# EAGLE design Main PCB (EAGLE 9.6.2)
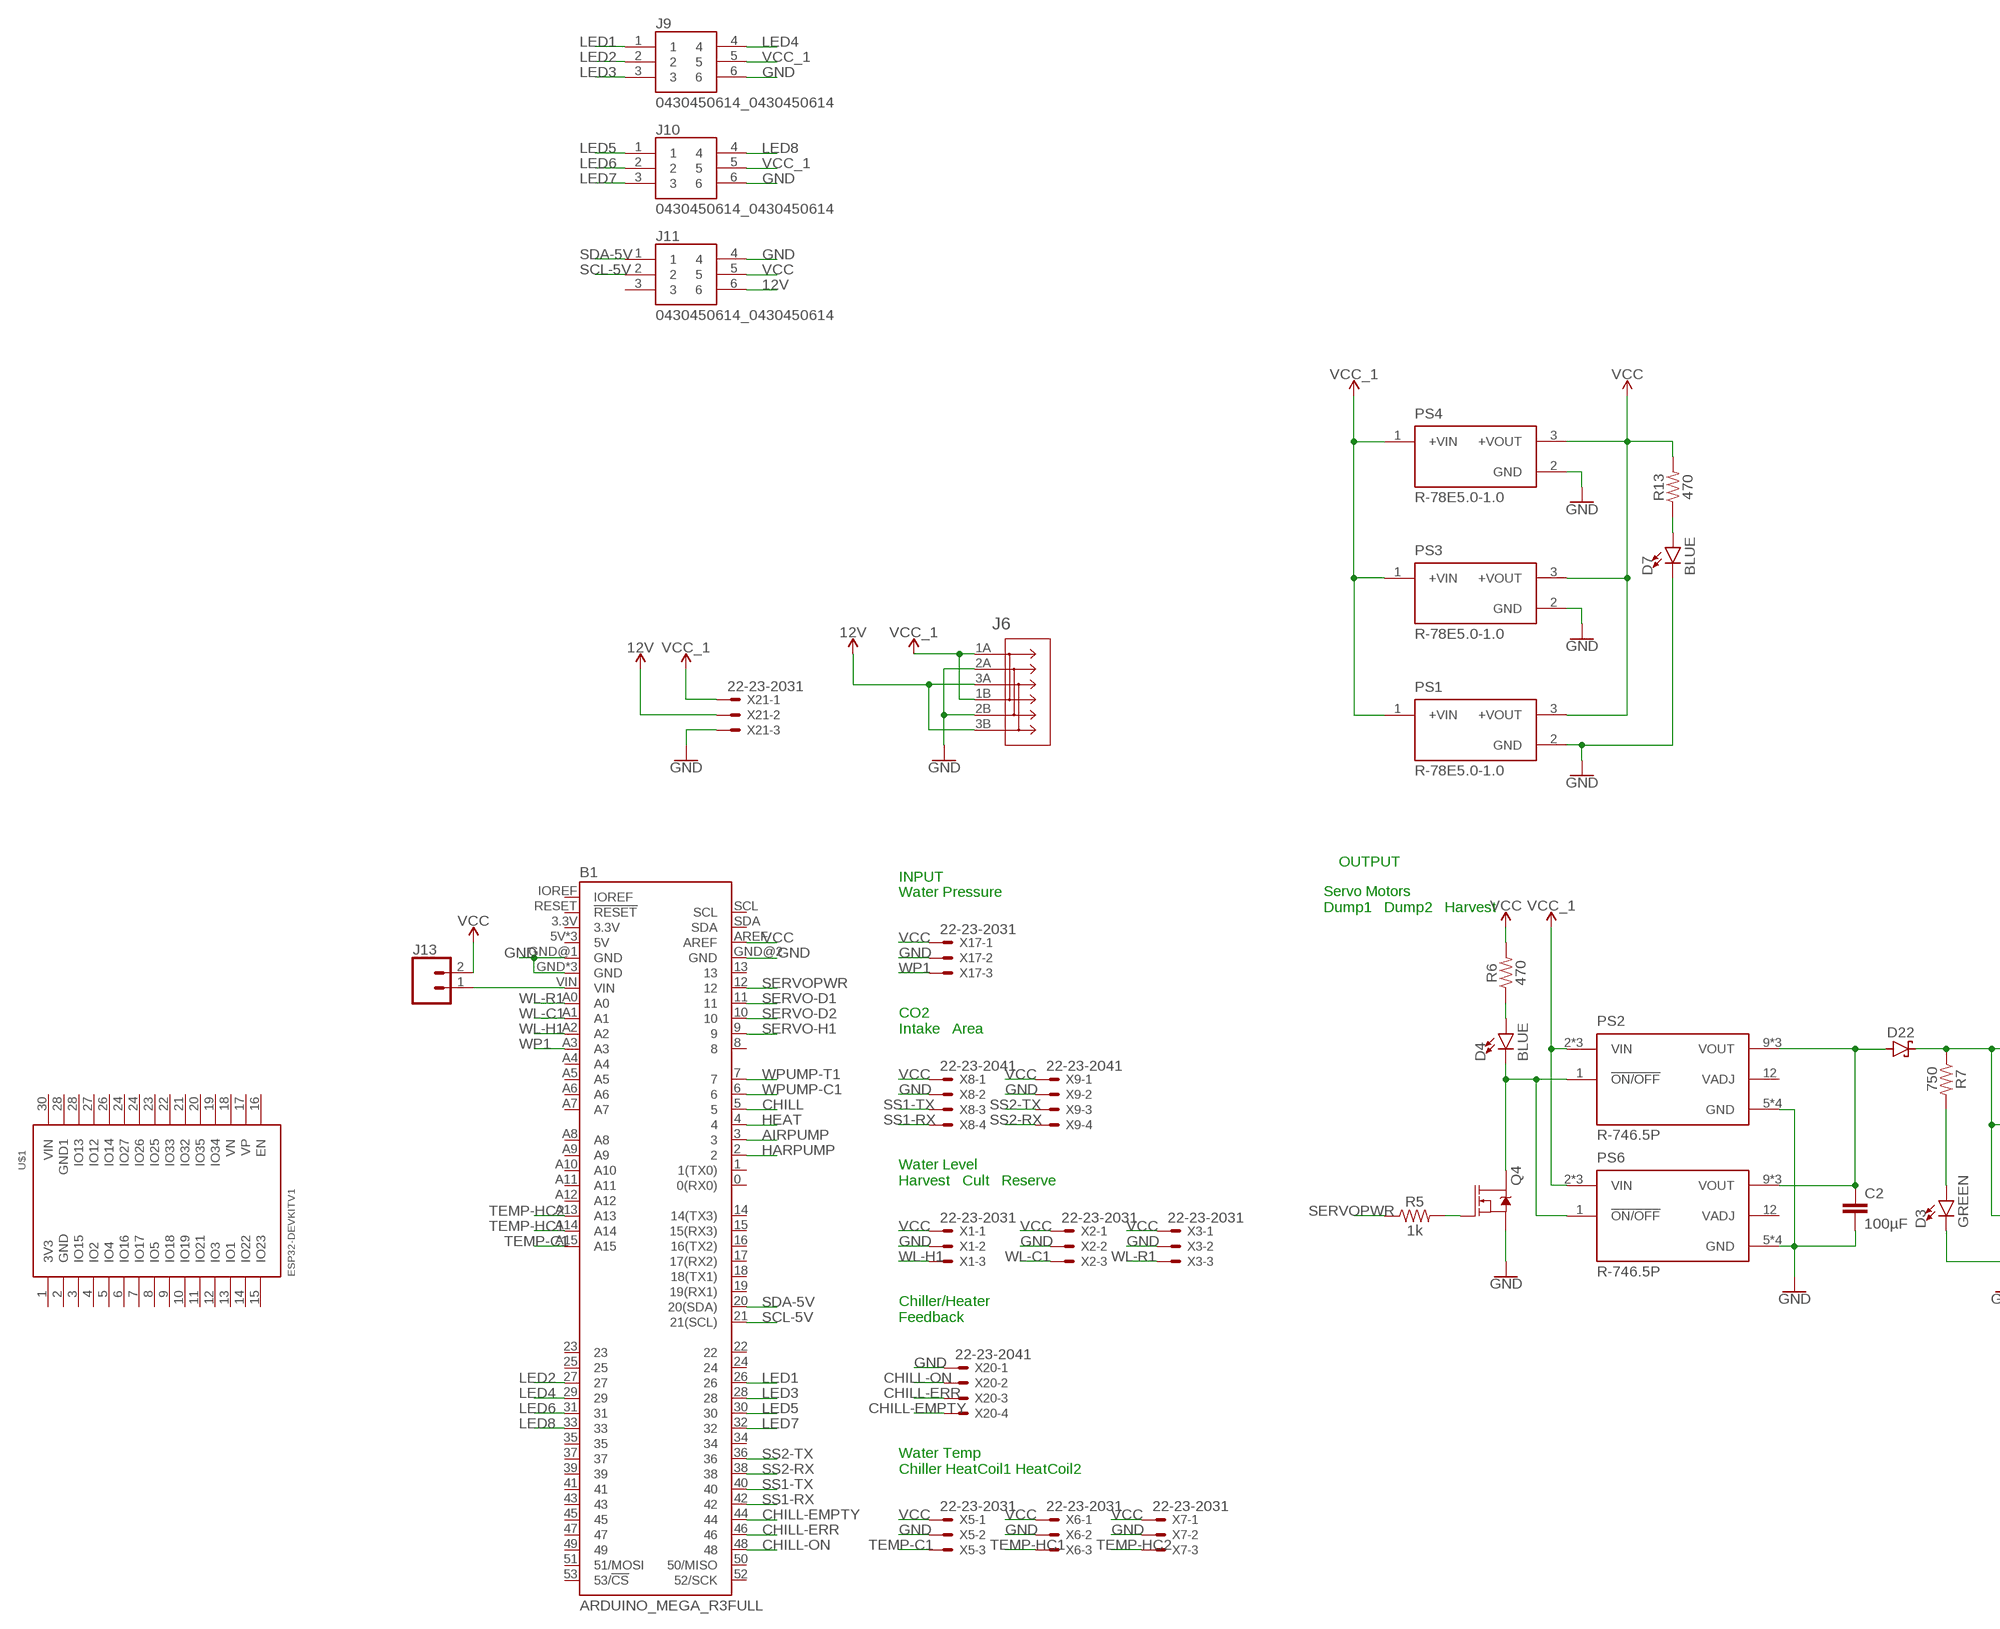
[diagram p0: schematic, sheet 1, part 1 of 2]
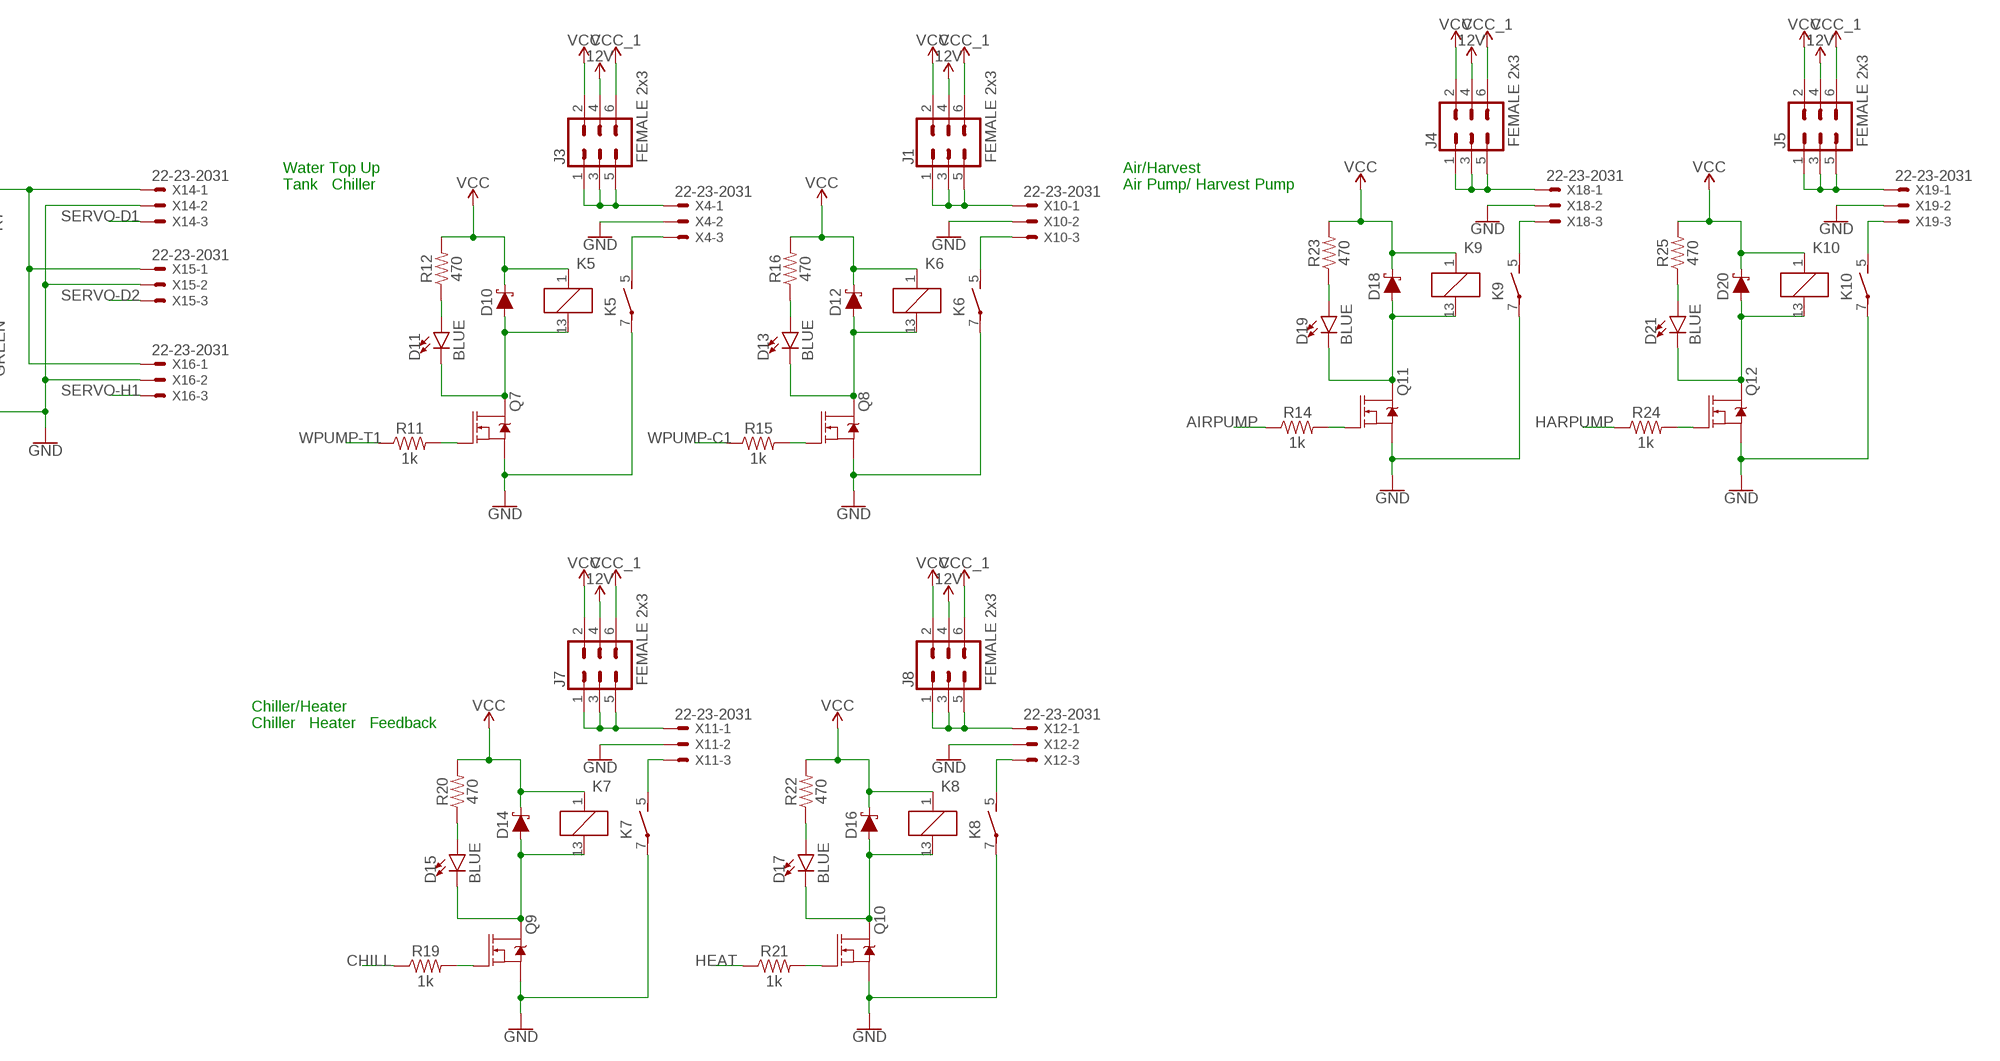
[diagram p1: schematic, sheet 1, part 2 of 2]

## Parts
B1  ARDUINO_MEGA_R3FULL  [ARDUINO_MEGA_NO_SILK]
C2  100µF  CAP-0603  [0603]
D3  GREEN  LED-GREEN0603  [LED-0603]
D4  BLUE  LED-BLUE0603  [LED-0603]
D7  BLUE  LED-BLUE0603  [LED-0603]
D10  1A/23V/620mV  DIODE-SCHOTTKY-BAT20J  [SOD-323]
D11  BLUE  LED-BLUE0603  [LED-0603]
D12  1A/23V/620mV  DIODE-SCHOTTKY-BAT20J  [SOD-323]
D13  BLUE  LED-BLUE0603  [LED-0603]
D14  1A/23V/620mV  DIODE-SCHOTTKY-BAT20J  [SOD-323]
D15  BLUE  LED-BLUE0603  [LED-0603]
D16  1A/23V/620mV  DIODE-SCHOTTKY-BAT20J  [SOD-323]
D17  BLUE  LED-BLUE0603  [LED-0603]
D18  1A/23V/620mV  DIODE-SCHOTTKY-BAT20J  [SOD-323]
D19  BLUE  LED-BLUE0603  [LED-0603]
D20  1A/23V/620mV  DIODE-SCHOTTKY-BAT20J  [SOD-323]
D21  BLUE  LED-BLUE0603  [LED-0603]
D22  SBRT20M60SP5-7SBRT20  [DIO_PDS360-13]
J1  FEMALE 2x3  CONN_03X2FEMALE  [2X3]
J3  FEMALE 2x3  CONN_03X2FEMALE  [2X3]
J4  FEMALE 2x3  CONN_03X2FEMALE  [2X3]
J5  FEMALE 2x3  CONN_03X2FEMALE  [2X3]
J6  1986711-3  [CONN3_1986711-3_TEC]
J7  FEMALE 2x3  CONN_03X2FEMALE  [2X3]
J8  FEMALE 2x3  CONN_03X2FEMALE  [2X3]
J9  0430450614_0430450614  [0430450614_MOLEX_0430450614]
J10  0430450614_0430450614  [0430450614_MOLEX_0430450614]
J11  0430450614_0430450614  [0430450614_MOLEX_0430450614]
J13  CONN_02  [1X02]
K5  G6D-1A-ASI5VDC  [G6D]
K6  G6D-1A-ASI5VDC  [G6D]
K7  G6D-1A-ASI5VDC  [G6D]
K8  G6D-1A-ASI5VDC  [G6D]
K9  G6D-1A-ASI5VDC  [G6D]
K10  G6D-1A-ASI5VDC  [G6D]
PS1  R-78E5.0-1.0  [CONV_R-78E5.0-1.0]
PS2  R-746.5P  [CONV_R-746.5P]
PS3  R-78E5.0-1.0  [CONV_R-78E5.0-1.0]
PS4  R-78E5.0-1.0  [CONV_R-78E5.0-1.0]
PS6  R-746.5P  [CONV_R-746.5P]
Q4  220mA/50V/3.5Ω  MOSFET-NCH-BSS138  [SOT23-3]
Q7  220mA/50V/3.5Ω  MOSFET-NCH-BSS138  [SOT23-3]
Q8  220mA/50V/3.5Ω  MOSFET-NCH-BSS138  [SOT23-3]
Q9  220mA/50V/3.5Ω  MOSFET-NCH-BSS138  [SOT23-3]
Q10  220mA/50V/3.5Ω  MOSFET-NCH-BSS138  [SOT23-3]
Q11  220mA/50V/3.5Ω  MOSFET-NCH-BSS138  [SOT23-3]
Q12  220mA/50V/3.5Ω  MOSFET-NCH-BSS138  [SOT23-3]
R5  1k  1KOHM-0603-1/10W-1%  [0603]
R6  470  470OHM-0603-1/10W-1%  [0603]
R7  750  750OHM-0603-1/10W-1%  [0603]
R11  1k  1KOHM-0603-1/10W-1%  [0603]
R12  470  470OHM-0603-1/10W-1%  [0603]
R13  470  470OHM-0603-1/10W-1%  [0603]
R14  1k  1KOHM-0603-1/10W-1%  [0603]
R15  1k  1KOHM-0603-1/10W-1%  [0603]
R16  470  470OHM-0603-1/10W-1%  [0603]
R19  1k  1KOHM-0603-1/10W-1%  [0603]
R20  470  470OHM-0603-1/10W-1%  [0603]
R21  1k  1KOHM-0603-1/10W-1%  [0603]
R22  470  470OHM-0603-1/10W-1%  [0603]
R23  470  470OHM-0603-1/10W-1%  [0603]
R24  1k  1KOHM-0603-1/10W-1%  [0603]
R25  470  470OHM-0603-1/10W-1%  [0603]
U$1  ESP32DEVKITV1  [ESP32-DEVKITV1]
X1  22-23-2031  [22-23-2031]
X2  22-23-2031  [22-23-2031]
X3  22-23-2031  [22-23-2031]
X4  22-23-2031  [22-23-2031]
X5  22-23-2031  [22-23-2031]
X6  22-23-2031  [22-23-2031]
X7  22-23-2031  [22-23-2031]
X8  22-23-2041  [22-23-2041]
X9  22-23-2041  [22-23-2041]
X10  22-23-2031  [22-23-2031]
X11  22-23-2031  [22-23-2031]
X12  22-23-2031  [22-23-2031]
X14  22-23-2031  [22-23-2031]
X15  22-23-2031  [22-23-2031]
X16  22-23-2031  [22-23-2031]
X17  22-23-2031  [22-23-2031]
X18  22-23-2031  [22-23-2031]
X19  22-23-2031  [22-23-2031]
X20  22-23-2041  [22-23-2041]
X21  22-23-2031  [22-23-2031]

## Nets
12V: J1.4 J3.4 J4.4 J5.4 J6.3A J6.3B J7.4 J8.4 J11.6 X21.2
AIRPUMP: B1.3 R14.1
CHILL: B1.5 R19.1
CHILL-EMPTY: B1.44 X20.4
CHILL-ERR: B1.46 X20.3
CHILL-ON: B1.48 X20.2
GND: B1.GND B1.GND@1(GND) B1.GND@2(GND) B1.GND@3(GND) B1.GND@4(GND) C2.2 D3.C D7.C J6.2A J6.2B J9.6 J10.6 J11.4 K5.7(2:P) K6.7(2:P) K7.7(2:P) K8.7(2:P) K9.7(2:P) K10.7(2:P) PS1.2(GND) PS2.5(GND) PS2.6(GND) PS2.7(GND) PS2.8(GND) PS3.2(GND) PS4.2(GND) PS6.5(GND) PS6.6(GND) PS6.7(GND) PS6.8(GND) Q4.2(S) Q7.2(S) Q8.2(S) Q9.2(S) Q10.2(S) Q11.2(S) Q12.2(S) X1.2 X2.2 X3.2 X4.2 X5.2 X6.2 X7.2 X8.2 X9.2 X10.2 X11.2 X12.2 X14.2 X15.2 X16.2 X17.2 X18.2 X19.2 X20.1 X21.3
HARPUMP: B1.2 R24.1
HEAT: B1.4 R21.1
LED1: B1.26 J9.1
LED2: B1.27 J9.2
LED3: B1.28 J9.3
LED4: B1.29 J9.4
LED5: B1.30 J10.1
LED6: B1.31 J10.2
LED7: B1.32 J10.3
LED8: B1.33 J10.4
N$1: B1.VIN J13.1
N$3: D4.C PS2.1(!ON/OFF) PS6.1(!ON/OFF) Q4.3(D)
N$5: D4.A R6.1
N$6: Q4.1(G) R5.2
N$7: D3.A R7.2
N$8: D22.3(C) R7.1 X14.1 X15.1 X16.1
N$9: J1.1 J1.3 J1.5 X10.1
N$10: J3.1 J3.3 J3.5 X4.1
N$11: K8.5(2:S) X12.3
N$12: J4.1 J4.3 J4.5 X18.1
N$13: J5.1 J5.3 J5.5 X19.1
N$14: D10.A D11.C K5.13 Q7.3(D)
N$15: D11.A R12.1
N$16: Q7.1(G) R11.2
N$17: D12.A D13.C K6.13 Q8.3(D)
N$18: D13.A R16.1
N$19: Q8.1(G) R15.2
N$20: D14.A D15.C K7.13 Q9.3(D)
N$21: D15.A R20.1
N$22: Q9.1(G) R19.2
N$23: D16.A D17.C K8.13 Q10.3(D)
N$24: D17.A R22.1
N$25: Q10.1(G) R21.2
N$26: K7.5(2:S) X11.3
N$28: J7.1 J7.3 J7.5 X11.1
N$29: D7.A R13.1
N$30: K5.5(2:S) X4.3
N$31: K6.5(2:S) X10.3
N$34: C2.1 D22.1(A) D22.2(A) PS2.9(VOUT) PS2.10(VOUT) PS2.11(VOUT) PS6.9(VOUT) PS6.10(VOUT) PS6.11(VOUT)
N$38: J8.1 J8.3 J8.5 X12.1
N$42: D18.A D19.C K9.13 Q11.3(D)
N$43: D19.A R23.1
N$44: Q11.1(G) R14.2
N$45: D20.A D21.C K10.13 Q12.3(D)
N$46: D21.A R25.1
N$47: Q12.1(G) R24.2
N$48: K10.5(2:S) X19.3
N$49: K9.5(2:S) X18.3
SCL-5V: B1.21(21(SCL)) J11.2
SDA-5V: B1.20(20(SDA)) J11.1
SERVO-D1: B1.11 X14.3
SERVO-D2: B1.10 X15.3
SERVO-H1: B1.9 X16.3
SERVOPWR: B1.12 R5.1
SS1-RX: B1.42 X8.4
SS1-TX: B1.40 X8.3
SS2-RX: B1.38 X9.4
SS2-TX: B1.36 X9.3
TEMP-C1: B1.A15 X5.3
TEMP-HC1: B1.A14 X6.3
TEMP-HC2: B1.A13 X7.3
VCC: B1.AREF D10.C D12.C D14.C D16.C D18.C D20.C J1.2 J3.2 J4.2 J5.2 J7.2 J8.2 J11.5 J13.2 K5.1 K6.1 K7.1 K8.1 K9.1 K10.1 PS1.3(+VOUT) PS3.3(+VOUT) PS4.3(+VOUT) R6.2 R12.2 R13.2 R16.2 R20.2 R22.2 R23.2 R25.2 X1.1 X2.1 X3.1 X5.1 X6.1 X7.1 X8.1 X9.1 X17.1
VCC_1: J1.6 J3.6 J4.6 J5.6 J6.1A J6.1B J7.6 J8.6 J9.5 J10.5 PS1.1(+VIN) PS2.2(VIN) PS2.3(VIN) PS2.4(VIN) PS3.1(+VIN) PS4.1(+VIN) PS6.2(VIN) PS6.3(VIN) PS6.4(VIN) X21.1
WL-C1: B1.A1 X2.3
WL-H1: B1.A2 X1.3
WL-R1: B1.A0 X3.3
WP1: B1.A3 X17.3
WPUMP-C1: B1.6 R15.1
WPUMP-T1: B1.7 R11.1
Unconnected: B1.0(0(RX0)) B1.1(1(TX0)) B1.3.3V B1.5V B1.5V@1(5V) B1.5V@2(5V) B1.8 B1.13 B1.14(14(TX3)) B1.15(15(RX3)) B1.16(16(TX2)) B1.17(17(RX2)) B1.18(18(TX1)) B1.19(19(RX1)) B1.22 B1.23 B1.24 B1.25 B1.34 B1.35 B1.37 B1.39 B1.41 B1.43 B1.45 B1.47 B1.49 B1.50(50/MISO) B1.51(51/MOSI) B1.52(52/SCK) B1.53(53/!CS) B1.A4 B1.A5 B1.A6 B1.A7 B1.A8 B1.A9 B1.A10 B1.A11 B1.A12 B1.IOREF B1.RESET(!RESET) B1.SCL B1.SDA J11.3 PS2.12(VADJ) PS6.12(VADJ) U$1.1(3V3) U$1.2(GND) U$1.3(IO15) U$1.4(IO2) U$1.5(IO4) U$1.6(IO16) U$1.7(IO17) U$1.8(IO5) U$1.9(IO18) U$1.10(IO19) U$1.11(IO21) U$1.12(IO3) U$1.13(IO1) U$1.14(IO22) U$1.15(IO23) U$1.16(EN) U$1.17(VP) U$1.18(VN) U$1.19(IO34) U$1.20(IO35) U$1.21(IO32) U$1.22(IO33) U$1.23(IO25) U$1.24(IO26) U$1.24(IO27) U$1.26(IO14) U$1.27(IO12) U$1.28(GND1) U$1.28(IO13) U$1.30(VIN)

## Notes on the sheet
- OUTPUT
- INPUT
- Water Pressure
- Servo Motors
  Dump1   Dump2   Harvest
- CO2
  Intake   Area
- Water Top Up
  Tank   Chiller
- Air/Harvest
  Air Pump/ Harvest Pump
- Water Level
  Harvest   Cult   Reserve
- Chiller/Heater
  Feedback
- Water Temp
  Chiller HeatCoil1 HeatCoil2
- Chiller/Heater
  Chiller   Heater   Feedback

## Library data of the parts
B1 = SparkFun-Boards:ARDUINO_MEGA_R3: Arduino Mega R3 ATmega2560 R3 compatible footprint. SparkFun Products: Arduino Mega 2560 R3 <https://www.sparkfun.com/products/11061>
C2 = SparkFun-Capacitors:CAP
D3 = SparkFun-LED:LED-GREEN: Green SMD LED Used in manufacturing of various products at SparkFun Packages: 0603 - SMD 0603 package [Product Link] <http://www.futureelectronics.com/en/technologies/semiconductors/optoelectronics/leds/Pages/9894312-LTST-C190GKT.aspx?CrossPart=HSMG-C190&IM=0> LilyPad 1206 - SMD1206 LilyPad package [Product Link] <http://www.futureelectronics.com/en/Technologies/Product.aspx?ProductID=IN150NGHARVATEKCORPORATION2049943&IM=0> 1206 - SMD1206 package [Product Link] <http://www.futureelectronics.com/en/technologies/semiconductors/optoelectronics/leds/Pages/8315665-LTST-C150KGKT.aspx?IM=0> 1206 Bottom Mount -SMD 1206 Bottom Mount [Product Link] <http://www.digikey.com/product-detail/en/lite-on-inc/LTST-C230KGKT/160-1456-1-ND/386854> SparkFun Products: Pro Mini 328 -5V <https://www.sparkfun.com/products/821> RedBoard <https://www.sparkfun.com/products/12757> MP3 Trigger <https://www.sparkfun.com/products/13720> Makey Makey <https://www.sparkfun.com/products/11076>; PROD_ID: DIO-00821
D4 D7 D11 D13 D15 D17 D19 D21 = SparkFun-LED:LED-BLUE: Blue SMD LED Used in manufacturing of various products at SparkFun Packages: 0603 - SMD 0603 package [Product Link] <http://www.digikey.com/product-detail/en/SMLE12BC7TT86/511-1589-2-ND/1641808> 1206 - SMD1206 package [Product Link] <http://www.digikey.com/product-detail/en/lite-on-inc/LTST-C150TBKT/160-1643-1-ND/573584> SparkFun Products: ESP8266 Thing-Dev Board <https://www.sparkfun.com/products/13711> RedBoard <https://www.sparkfun.com/products/12757>; PROD_ID: DIO-08575
D10 D12 D14 D16 D18 D20 = SparkFun-DiscreteSemi:DIODE-SCHOTTKY: Schottky diode A Schottky diode is a semiconductor diode which has a low forward voltage drop and a very fast switching action.; PROD_ID: DIO-11623
D22 = DIO_PDS360-13:SBRT20M60SP5-7: DIODE transient voltage suppressor
J1 J3-J5 J7 J8 = SparkFun-Connectors:CONN_03X2: Multi connection point. Often used as Generic Header-pin footprint for 0.1 inch spaced/style header connections You can populate with any combo of single row headers, but if you'd like an exact match, check these: Header - 2x3 (Male, 0.1") <https://www.sparkfun.com/products/12807> (PRT-12807) Header - 2x3 (Female, 0.1") <https://www.sparkfun.com/products/13010> (PRT-13010) 2x3 Pin Shrouded Header <https://www.sparkfun.com/products/10877> (PRT-10877) On any of the 0.1 inch spaced packages, you can populate with these: Break Away Headers - Straight <https://www.sparkfun.com/products/116> (PRT-00116) Break Away Male Headers - Right Angle <https://www.sparkfun.com/products/553> (PRT-00553) Female Headers <https://www.sparkfun.com/products/115> (PRT-00115) Break Away Headers - Machine Pin <https://www.sparkfun.com/products/117> (PRT-00117) Break Away Female Headers - Swiss Machine Pin <https://www.sparkfun.com/products/743> (PRT-00743) Special note: the shrouded connector mates well with our 3x2 ribbon cables: Ribbon Crimp Connector - 6-pin (2x3, Female) <https://www.sparkfun.com/products/10651> (PRT-10651) Ribbon Cable - 6 wire (15ft) <https://www.sparkfun.com/products/10646> (PRT-10646); PROD_ID: CONN-11566
J6 = TERM BLK 3POS SIDE ENTRY 5MM PCB:1986711-3; BUILT_BY: SunStream; COPYRIGHT: Copyright (C) 2018 Accelerated Designs. All rights reserved; DATASHEET: https://www.te.com/commerce/DocumentDelivery/DDEController?Action=showdoc&DocId=Customer+Drawing%7F1986711%7FC%7Fpdf%7FEnglish%7FENG_CD_1986711_C.pdf%7F1986711-3; DESCRIPTION: SPRING TYPE. SIDE WIRE ENTRY TERMINAL BLOCK SIDE STACKABLE STRAIGHT 02 - 25 POLES PITCH 5.00mm; MANUFACTURER_PART_NUMBER: 1986711-3; SOURCELIBRARY: TE_Connectivity_600_Part_Delivery_14_2020-03-09; VENDOR: TE Connectivity
J9-J11 = LED:0430450614_0430450614: Conn Power HDR 6 POS 3mm Solder ST Thru-Hole 6 Terminal 1 Port Micro-Fit 3.0Ã¢â¢ Tray; AVAILABILITY: Unavailable; DESCRIPTION: Connector Header Through Hole 6 position 0.118 _3.00mm_; MF: Molex; MP: 0430450614; PACKAGE: None; PRICE: None
J13 = SparkFun-Connectors:CONN_02: Multi connection point. Often used as Generic Header-pin footprint for 0.1 inch spaced/style header connections On any of the 0.1 inch spaced packages, you can populate with these: Break Away Headers - Straight <https://www.sparkfun.com/products/116> (PRT-00116) Break Away Male Headers - Right Angle <https://www.sparkfun.com/products/553> (PRT-00553) Female Headers <https://www.sparkfun.com/products/115> (PRT-00115) Break Away Headers - Machine Pin <https://www.sparkfun.com/products/117> (PRT-00117) Break Away Female Headers - Swiss Machine Pin <https://www.sparkfun.com/products/743> (PRT-00743) For SCREWTERMINALS and SPRING TERMINALS visit here: Screw Terimnals on SparkFun.com <https://www.sparkfun.com/search/results?term=Screw+Terminals> (5mm/3.5mm/2.54mm spacing) This device is also useful as a general connection point to wire up your design to another part of your project. Our various solder wires solder well into these plated through hole pads. Hook-Up Wire - Assortment (Stranded, 22 AWG) <https://www.sparkfun.com/products/11375> (PRT-11375) Hook-Up Wire - Assortment (Solid Core, 22 AWG) <https://www.sparkfun.com/products/11367> (PRT-11367) View the entire wire category on our website here <https://www.sparkfun.com/categories/141> Special notes: Molex polarized connector foot print use with: PRT-08233 with associated crimp pins and housings. 2.54_SCREWTERM for use with PRT-10571. 3.5mm Screw Terminal footprints for PRT-08084 5mm Screw Terminal footprints for use with PRT-08432
K5-K10 = relay:G6D?*: OMRON Slim, Miniature PCB Relay 17.5 × 6.5 × 12.5 mm with Socked Source: http://ecb.omron.com.sg/pdf/relay/power/G6D.pdf; OC_FARNELL: 9812660; OC_NEWARK: unknown
PS1 PS3 PS4 = R-78E5.0-1.0:R-78E5.0-1.0: 1.0 Amp SIP3 Single Output; ARROW_ELECTRONICS-PURCHASE-URL: https://snapeda.com/shop?store=Arrow+Electronics&id=557753; DESCRIPTION: 1A DC/DC-Converter 'INNOLINE' SIP3 reg; DIGI-KEY_PART_NUMBER: 945-2201-ND; DIGIKEY-PURCHASE-URL: https://snapeda.com/shop?store=DigiKey&id=557753; MF: Recom Power; MOUSER-PURCHASE-URL: https://snapeda.com/shop?store=Mouser&id=557753; MP: R-78E5.0-1.0; PACKAGE: SIP-3 Recom Power
PS2 PS6 = R-746.5P:R-746.5P: 2,3,4 Amp SIP12 Vertical & Horizontal Single Output; DESCRIPTION: 4A DC/DC-Converter 'INNOLINE' SIP12 reg; DIGI-KEY_PART_NUMBER: 945-1029-ND; MF: Recom Power; MP: R-746.5P; PACKAGE: SIP-12 Recom Power
Q4 Q7-Q12 = SparkFun-DiscreteSemi:MOSFET-NCH: N-channel MOSFETs Voltage controlled devices that allow control of high current outputs. SparkFun Products: SparkFun OpenScale <https://www.sparkfun.com/products/13261> SparkFun Digital Sandbox <https://www.sparkfun.com/products/12651> SparkFun Monster Moto Shield <https://www.sparkfun.com/products/10182> SparkFun MOSFET Power Controller <https://www.sparkfun.com/products/11214>; PROD_ID: TRANS-00830
R5 R11 R14 R15 R19 R21 R24 = SparkFun-Resistors:1KOHM: 1kΩ resistor A resistor is a passive two-terminal electrical component that implements electrical resistance as a circuit element. Resistors act to reduce current flow, and, at the same time, act to lower voltage levels within circuits. - Wikipedia; PROD_ID: RES-07856
R6 R12 R13 R16 R20 R22 R23 R25 = SparkFun-Resistors:470OHM: 470Ω resistor A resistor is a passive two-terminal electrical component that implements electrical resistance as a circuit element. Resistors act to reduce current flow, and, at the same time, act to lower voltage levels within circuits. - Wikipedia; PROD_ID: RES-07869
R7 = SparkFun-Resistors:750OHM: 750Ω resistor A resistor is a passive two-terminal electrical component that implements electrical resistance as a circuit element. Resistors act to reduce current flow, and, at the same time, act to lower voltage levels within circuits. - Wikipedia; PROD_ID: RES-07824
U$1 = ESP32-DEVKITV1:ESP32DEVKITV1
X1-X7 X10-X12 X14-X19 X21 = con-molex:22-23-2031: .100" (2.54mm) Center Header - 3 Pin; MF: MOLEX; MPN: 22-23-2031; OC_FARNELL: 1462950; OC_NEWARK: 30C0862
X8 X9 X20 = con-molex:22-23-2041: .100" (2.54mm) Center Header - 4 Pin; MF: MOLEX; MPN: 22-23-2041; OC_FARNELL: 1462920; OC_NEWARK: 38C0355

## Board
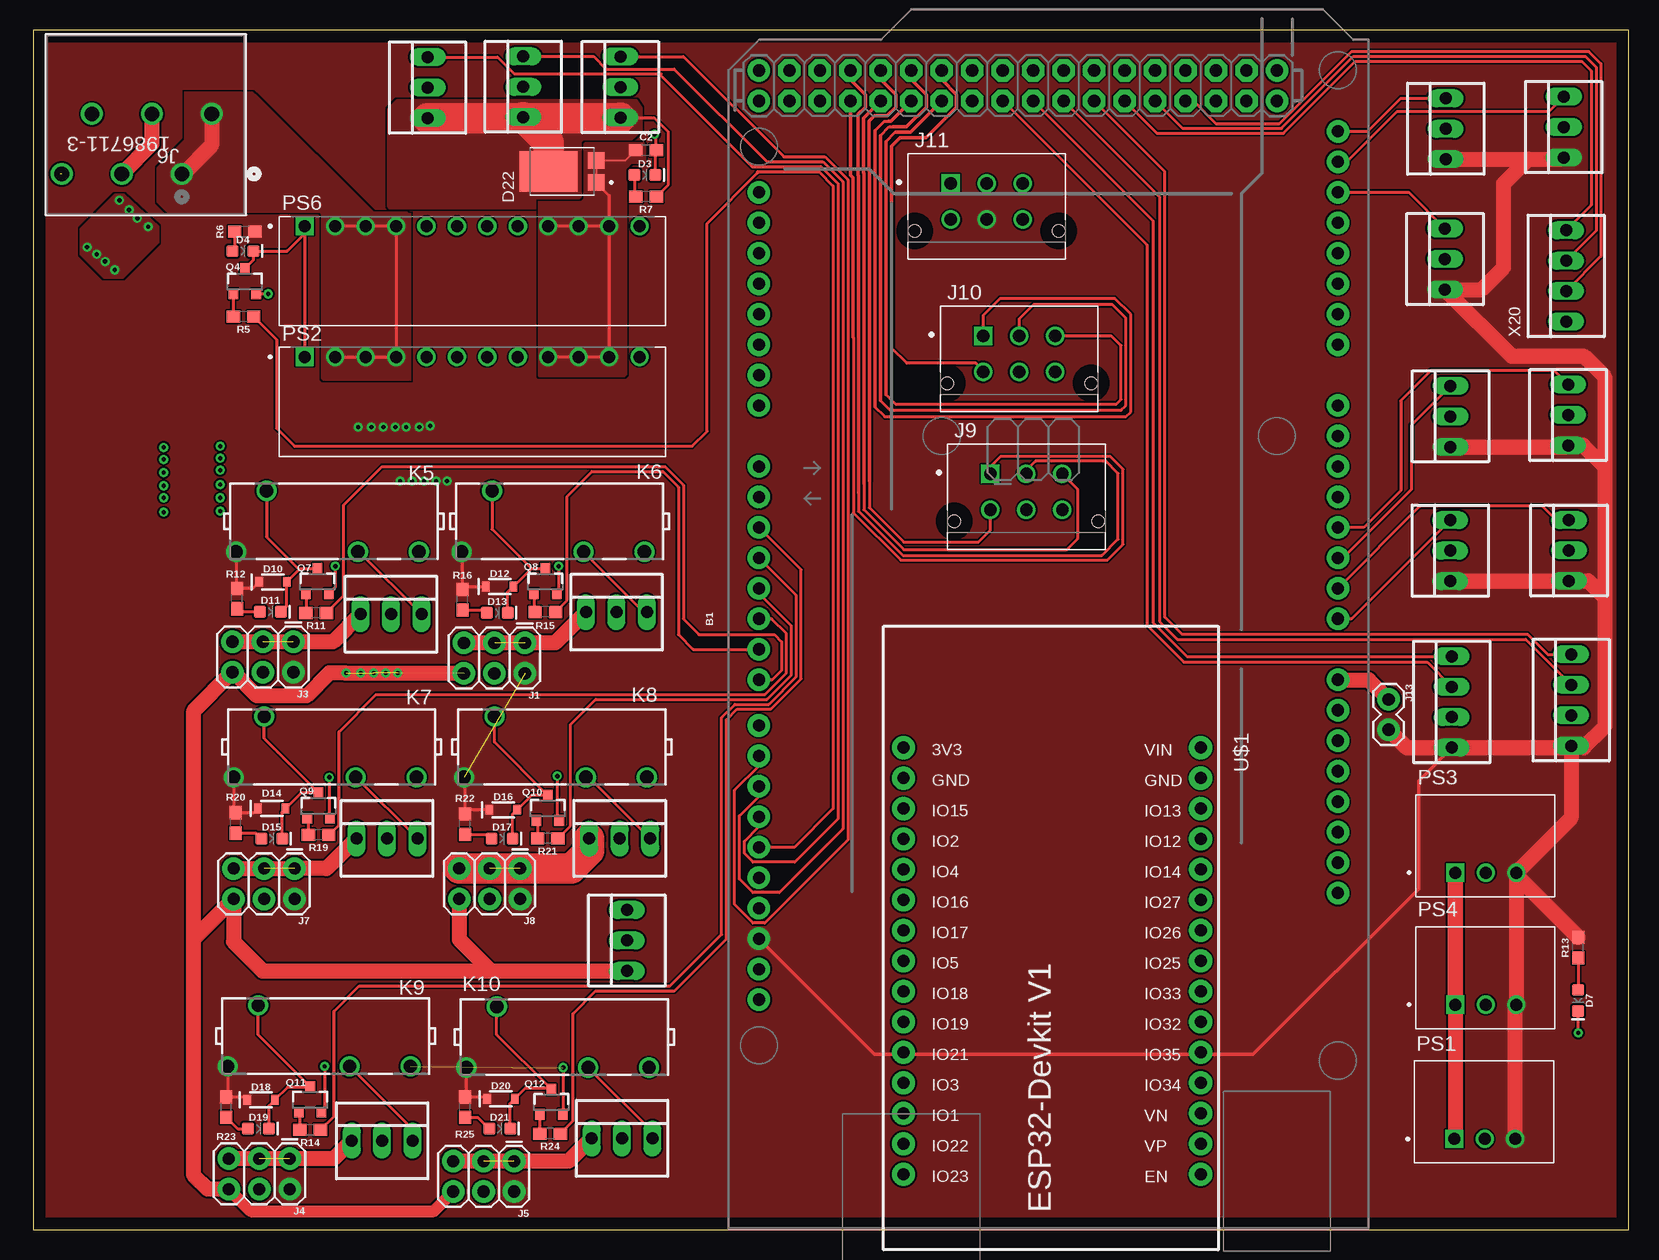
[diagram p2: board, top side]
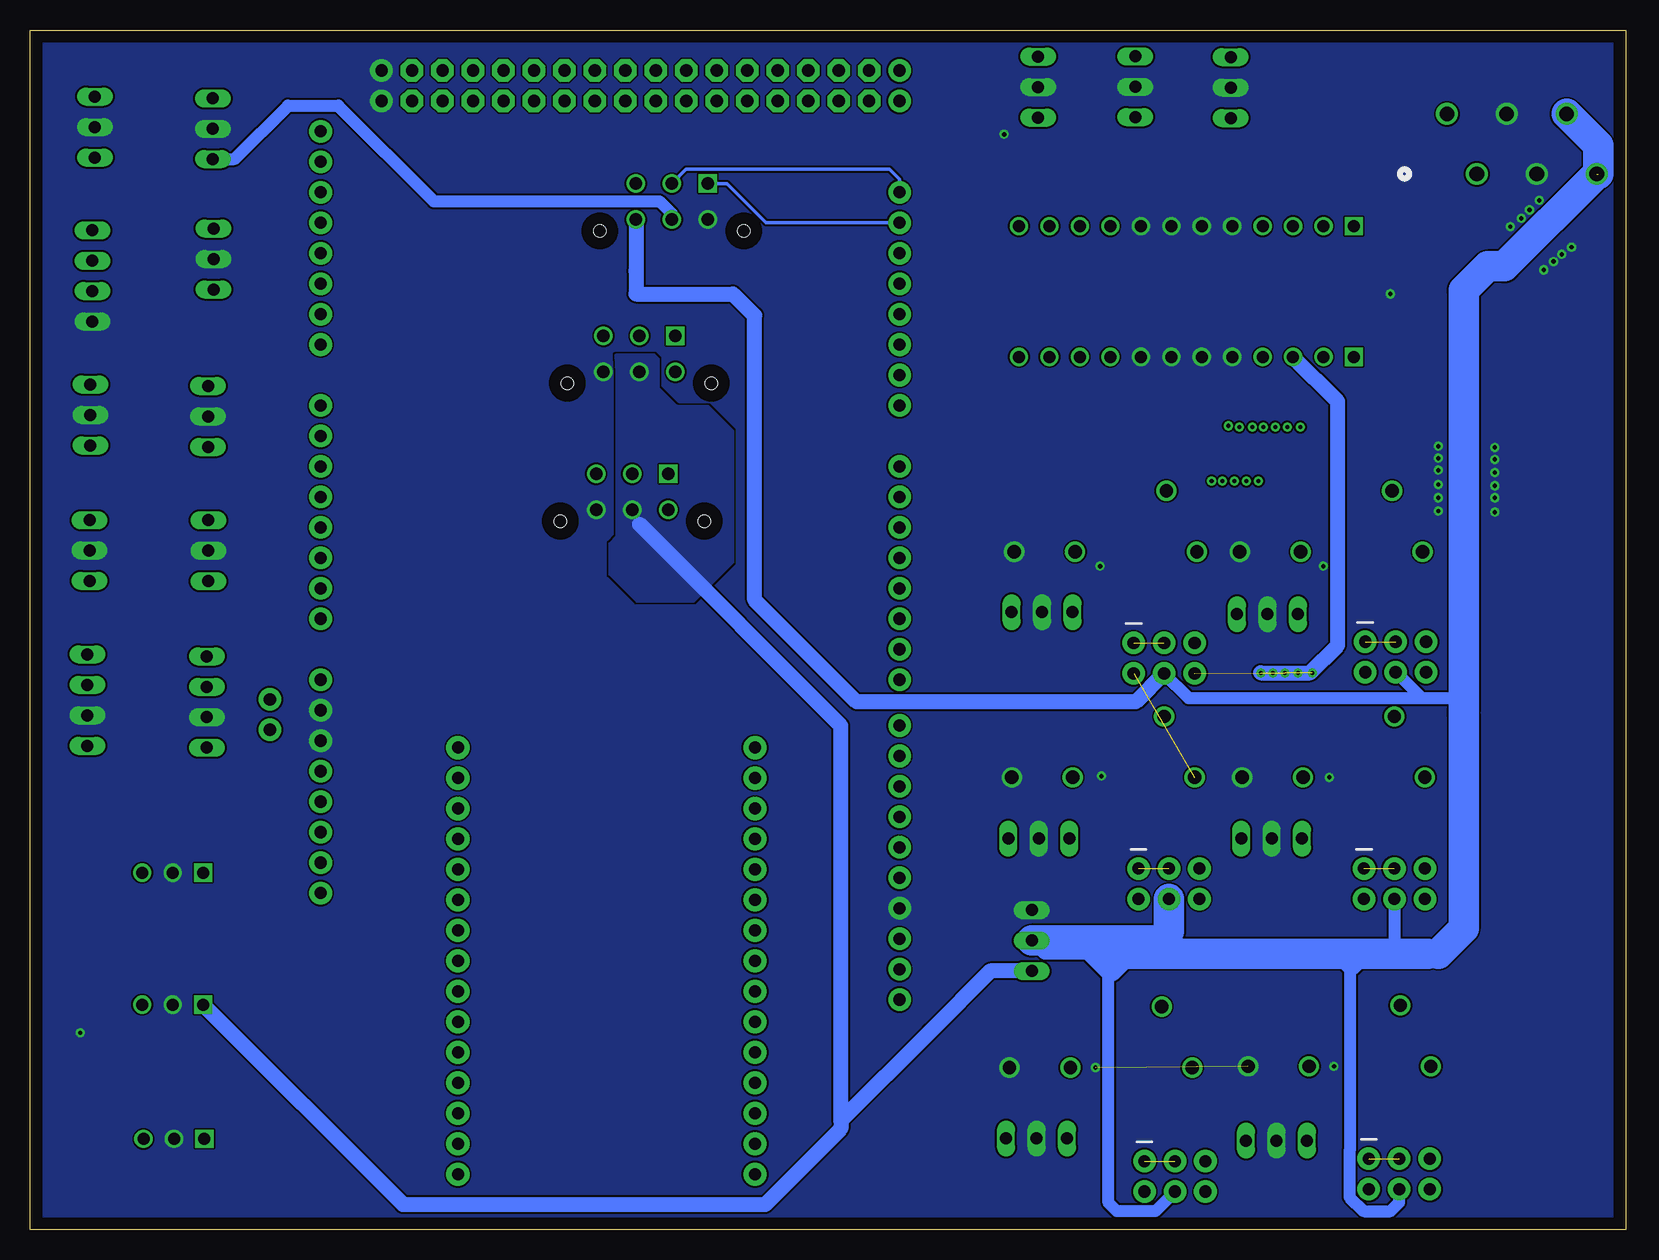
[diagram p3: board, bottom side, seen from below]

Size 133 x 100 mm. Coordinates in mm from the lower left corner, seen from the top.
Outline: 0,0 133,0 133,100 0,100 0,0
Copper layers (1*16): Top 0.035mm / dielectric 1.5mm / Bottom 0.035mm
Design rules "default": minimum track width 6mil, minimum drill 0.35mm, track to track 6mil, track to pad 6mil, pad to pad 6mil, via to via 6mil, smd to smd 6mil, copper to edge 40mil, drill to drill 6mil, minimum pad ring 10mil, minimum via ring 8mil, stop-mask expansion 4mil, vias tented up to drill 0mil, thermal gap 10mil

### Footprints (pad centres in the part's own frame; a part is rotated, then mirrored left to right if it is on the bottom)
ARDUINO_MEGA_NO_SILK = drill 1.016 pad 1.88: 0 13.97,24.13; 1 11.43,24.13; 2 8.89,24.13; 3 6.35,24.13; 3.3V -13.97,-24.13; 4 3.81,24.13; 5 1.27,24.13; 5V -11.43,-24.13; 5V@1 44.45,24.13; 5V@2 46.99,24.13; 6 -1.27,24.13; 7 -3.81,24.13; 8 -7.62,24.13; 9 -10.16,24.13; 10 -12.7,24.13; 11 -15.24,24.13; 12 -17.78,24.13; 13 -20.32,24.13; 14 19.05,24.13; 15 21.59,24.13; 16 24.13,24.13; 17 26.67,24.13; 18 29.21,24.13; 19 31.75,24.13; 20 34.29,24.13; 21 36.83,24.13; A0 1.27,-24.13; A1 3.81,-24.13; A2 6.35,-24.13; A3 8.89,-24.13; A4 11.43,-24.13; A5 13.97,-24.13; A6 16.51,-24.13; A7 19.05,-24.13; A8 24.13,-24.13; A9 26.67,-24.13; A10 29.21,-24.13; A11 31.75,-24.13; A12 34.29,-24.13; A13 36.83,-24.13; A14 39.37,-24.13; A15 41.91,-24.13; AREF -25.4,24.13; GND -8.89,-24.13; GND@1 -6.35,-24.13; GND@2 44.45,-19.05; GND@3 46.99,-19.05; GND@4 -22.86,24.13; IOREF -19.05,-24.13; NC -21.59,-24.13; RESET -16.51,-24.13; SCL -30.48,24.13; SDA -27.94,24.13; VIN -3.81,-24.13 | drill 1.016 pad 1.88 octagon: 22 44.45,21.59; 23 46.99,21.59; 24 44.45,19.05; 25 46.99,19.05; 26 44.45,16.51; 27 46.99,16.51; 28 44.45,13.97; 29 46.99,13.97; 30 44.45,11.43; 31 46.99,11.43; 32 44.45,8.89; 33 46.99,8.89; 34 44.45,6.35; 35 46.99,6.35; 36 44.45,3.81; 37 46.99,3.81; 38 44.45,1.27; 39 46.99,1.27; 40 44.45,-1.27; 41 46.99,-1.27; 42 44.45,-3.81; 43 46.99,-3.81; 44 44.45,-6.35; 45 46.99,-6.35; 46 44.45,-8.89; 47 46.99,-8.89; 48 44.45,-11.43; 49 46.99,-11.43; 50 44.45,-13.97; 51 46.99,-13.97; 52 44.45,-16.51; 53 46.99,-16.51
0603 = smd 1.1 x 1: 1 -0.85,0; 2 0.85,0
LED-0603 = smd 1 x 1: A -0.877,0; C 0.877,0
SOD-323 = smd 0.63 x 0.83: A 1.15,0; C -1.15,0
DIO_PDS360-13 = smd 1.39 x 1.4: 1 -0.92,-2.856; 2 0.92,-2.856 | smd 3.36 x 4.86: 3 0,1.126
2X3 = drill 1.016 pad 1.88: 1 0,0; 2 0,2.54; 3 2.54,0; 4 2.54,2.54; 5 5.08,0; 6 5.08,2.54
CONN3_1986711-3_TEC = drill 1.219 pad 1.727: 1A 0,0; 1B -2.489,-5.004; 2A 5.004,0; 2B 2.489,-5.004; 3A 10.008,0; 3B 7.493,-5.004
0430450614_MOLEX_0430450614 = drill 1.02 square: 1 -3,1.5 | drill 1.02: 2 0,1.5; 3 3,1.5; 4 -3,-1.5; 5 0,-1.5; 6 3,-1.5 | hole 1.02: 6,-2.44; -6,-2.44
1X02 = drill 1.016 pad 1.88: 1 0,0; 2 2.54,0
G6D = drill 1.1 pad 1.676: 1 8.08,2.5; 5 -2.08,2.5; 7 -7.16,2.5; 13 5.54,-2.58
CONV_R-78E5.0-1.0 = drill 1 square: 1 -2.54,-2.25 | drill 1: 2 0,-2.25; 3 2.54,-2.25
CONV_R-746.5P = drill 1 square: 1 -13.97,3.75 | drill 1: 2 -11.43,3.75; 3 -8.89,3.75; 4 -6.35,3.75; 5 -3.81,3.75; 6 -1.27,3.75; 7 1.27,3.75; 8 3.81,3.75; 9 6.35,3.75; 10 8.89,3.75; 11 11.43,3.75; 12 13.97,3.75
SOT23-3 = smd 0.8 x 0.9: 1 -0.95,-1; 2 0.95,-1; 3 0,1.1
ESP32-DEVKITV1 = drill 1 pad 1.93: 1 -22.87,-13.54; 2 -20.33,-13.54; 3 -17.79,-13.54; 4 -15.25,-13.54; 5 -12.71,-13.54; 6 -10.17,-13.54; 7 -7.63,-13.54; 8 -5.09,-13.54; 9 -2.55,-13.54; 10 -0.01,-13.54; 11 2.53,-13.54; 12 5.07,-13.54; 13 7.61,-13.54; 14 10.15,-13.54; 15 12.69,-13.54; 16 12.69,11.23; 17 10.15,11.23; 18 7.61,11.23; 19 5.07,11.23; 20 2.53,11.23; 21 -0.01,11.23; 22 -2.55,11.23; 23 -5.09,11.23; 24 -7.63,11.23; 25 -10.17,11.23; 26 -12.71,11.23; 27 -15.25,11.23; 28 -17.79,11.23; 29 -20.33,11.23; 30 -22.87,11.23
22-23-2031 = drill 1 long: 1 -2.54,0; 2 0,0; 3 2.54,0
22-23-2041 = drill 1 long: 1 -3.81,0; 2 -1.27,0; 3 1.27,0; 4 3.81,0

### Placement (x,y rotation side)
B1  84.64,49.64 90 top
C2  51.1,90 0 top
D3  51,87.9 0 top
D4  17.49,81.57 0 top
D7  128.8,19.1 270 top
D10  20,54 0 top
D11  19.8,51.5 0 top
D12  38.9,53.6 0 top
D13  38.7,51.4 0 top
D14  19.9,35.1 0 top
D15  19.9,32.6 0 top
D16  39.2,35 0 top
D17  39.1,32.6 0 top
D18  19,10.8 0 top
D19  18.8,8.4 0 top
D20  39,10.9 0 top
D21  38.9,8.4 0 top
D22  44.1,88.2 90 top
J1  41,48.9 180 top
J3  21.7,49 180 top
J4  21.4,5.9 180 top
J5  40.1,5.7 180 top
J6  12.4,88 180 top
J7  21.8,30.1 180 top
J8  40.6,30.1 180 top
J9  82.8,61.5 0 top
J10  82.2,73 0 top
J11  79.5,85.7 0 top
J13  113,44.2 270 top
K5  25,59 180 top
K6  43.8,59 180 top
K7  24.8,40.2 180 top
K8  44,40.2 180 top
K9  24.3,16.1 180 top
K10  44.2,16 180 top
PS1  121,9.8 0 top
PS2  36.6,69 0 top
PS3  121.1,32 0 top
PS4  121.1,21 0 top
PS6  36.6,79.9 0 top
Q4  17.65,79.01 0 top
Q7  23.7,54 0 top
Q8  42.7,54 0 top
Q9  23.8,35.3 0 top
Q10  42.9,35.1 0 top
Q11  23.1,10.8 0 top
Q12  43.2,10.6 0 top
R5  17.55,76.1 180 top
R6  17.65,83.2 0 top
R7  51.1,86.1 180 top
R11  23.6,51.4 180 top
R12  17,52.6 90 top
R13  128.8,23.5 90 top
R14  23.1,8.3 180 top
R15  42.7,51.5 180 top
R16  35.8,52.5 90 top
R19  23.8,32.9 180 top
R20  16.9,33.9 90 top
R21  42.9,32.6 180 top
R22  36,33.8 90 top
R23  16.1,10.2 90 top
R24  43.1,8 180 top
R25  36,10.2 90 top
U$1  86.1,17.3 270 top
X1  118.16,67.79 90 top
X2  128.03,56.6 90 top
X3  118.14,56.6 90 top
X4  29.84,51.3 0 top
X5  117.76,91.77 90 top
X6  127.6,91.91 90 top
X7  117.7,80.9 90 top
X8  128.22,44.13 90 top
X9  118.26,43.98 90 top
X10  48.64,51.47 0 top
X11  29.5,32.6 0 top
X12  48.9,32.6 0 top
X14  32.9,95.2 90 top
X15  40.86,95.27 90 top
X16  48.96,95.24 90 top
X17  127.96,67.91 90 top
X18  29.1,7.4 0 top
X19  49.1,7.6 0 top
X20  127.8,79.5 90 top
X21  49.5,24.1 90 top

### Tracks (layer width: path | path; a pad name or v marks a point on that pad's centre or on a via)
12V  (1 unrouted)
  Bottom 1.016: J7.4 19.26,24.04 20.3,23 | 20.3,23 21.4,23 | 21.4,23 23,23 | 23,23 24.3,23 | 24.3,23 40.9,23 | 40.9,23 42.3,23 | 42.3,23 44.9,23 | 44.9,23 48.4,23 X21.2 | J5.4 39.2,1.52 42.4,1.52 43.1,2.22 43.1,21.2 | 43.1,22.2 43.1,23.4 43.1,24 43,24.1 | 23,23 23,21.7 | 23,21.7 23,6.56 | 23,6.56 | 23,6.56 23,2.7 21.83,1.52 19.6,1.52 18.86,2.26 J4.4 | J3.4 17,44.3 | 17,44.3 14.6,44.3 13.5,43.2 13.5,43 | 15.6,23 16.5,23 20.3,23 | J1.4 36.4,44.3 17,44.3 | 23,21.7 24.3,23 | 21.4,23 22.7,21.7 23,21.7 | 43.1,21.2 44.9,23 | 43.1,21.2 42.7,21.2 40.9,23 | 43.1,21.2 43.1,22.2 | 43.1,22.2 42.3,23
  Bottom 1.27: J1.4 40.82,44 64.1,44 72.6,52.5 72.6,76.2 74.4,78 82.5,78 J11.6 82.5,79.9
  Bottom 2.54: J8.4 38.06,24.84 38.8,24.1 43,24.1 X21.2 | J6.3A 10.09,80.3 11.5,80.3 13.5,78.3 13.5,43.2 | 15.6,23 13.5,25.1 13.5,43 | 16.5,23 42.7,23 43.1,23.4 | J6.3B 2.29,90.38 2.29,88
AIRPUMP
  Top 0.254: R14.1 25.1,9.45 25.1,18.2 27.2,20.3 53.1,20.3 57.4,24.6 57.4,42.69 58.5,43.79 61.34,43.79 63.62,46.07 63.62,52.88 B1.3
CHILL
  Top 0.254: R19.1 25.5,33.75 25.5,41.5 28.6,44.6 61,44.6 62.81,46.4 62.81,49.67 61.57,50.91 B1.5
CHILL-EMPTY
  Top 0.254: B1.44 93.69,91.39 104.24,91.39 110.24,97.39 129.1,97.39 129.89,96.6 129.89,85.4 X20.4
CHILL-ERR
  Top 0.254: B1.46 95.83,91.79 104.07,91.79 110.07,97.79 129.4,97.79 130.29,96.9 130.29,83.26 X20.3
CHILL-ON
  Top 0.254: B1.48 96.71,94.09 98.6,92.2 103.9,92.2 109.9,98.2 129.7,98.2 130.7,97.2 130.7,81.13 X20.2
GND  (via drill 0.35)  (1 unrouted)
  Top 0.254: D3.C 51.88,89.93 | 51.88,89.93 C2.2 | v51.8,91.3 51.88,91.22 51.88,89.93 | Q4.2 v19.59,78.01 v19.6,78 | v43.8,55.3 43.8,53.15 Q8.2 | v25.2,55.3 25.2,53.55 Q7.2 | v43.7,37.8 43.7,34.25 Q10.2 | v24.7,37.7 24.7,34.35 Q9.2 | v24.3,13.6 24.3,10.05 Q11.2 | v44.2,13.5 44.2,9.65 Q12.2 | v128.8,16.4 D7.C
  Top 1.27: J6.2B 9.91,90.52 J6.2A
  other vias: 10.9,65.2 10.9,64.2 10.9,63.1 10.9,62 10.9,61 10.9,59.8 15.6,59.9 15.6,61 15.6,62.1 15.6,63.3 15.6,64.3 15.6,65.3 4.5,81.9 5.3,81.3 6,80.7 6.8,80 7.2,85.8 8,85 8.7,84.3 9.6,83.6
  pour Bottom (isolate 0.1, rank 2, no thermals): 0.8,102.3 -0.6,102.3 -2.3,100.6 -2.3,0 0.6,-2.9 133.5,-2.9 135.9,-0.5 135.9,100 133.9,102 6.5,102 6.4,102.1
  pour Top (isolate 0.1, no thermals): 7.6,86.3 6.8,86.3 3.9,83.4 3.9,81.3 4,81.2 5.9,79.3 7.5,79.3 10.5,82.3 10.5,83.6
HARPUMP
  Top 0.254: R24.1 45,9.05 45,18 46.89,19.89 53.47,19.89 57.81,24.23 57.81,42.5 58.69,43.38 61.51,43.38 64.03,45.9 64.03,55.01 B1.2
HEAT
  Top 0.254: R21.1 44.8,33.65 44.8,42.1 46.89,44.19 61.17,44.19 63.21,46.23 63.21,50.33 60.51,53.03 B1.4
LED1
  Top 0.254: 68.35,74.4 68.38,74.38 68.38,59.75 72.33,55.79 89.55,55.79 90.86,57.11 90.86,63.39 89.8,64.45 80.65,64.45 79.8,63.6 J9.1
  Top 0.305: B1.26 68.13,87.91 68.35,87.68 68.35,74.4
LED2
  Top 0.254: 68.81,61.44 68.81,59.89 72.5,56.2 89.1,56.2 90.45,57.55 90.45,63.02 89.43,64.04 83.57,64.04 82.8,63.28 J9.2
  Top 0.305: B1.27 68.13,95.85 69.38,94.61 69.38,93.57 68.79,92.99 68.79,87.89 68.81,87.87 68.81,61.44
LED3
  Top 0.254: 69.27,62.2 69.27,60.01 72.59,56.69 86.19,56.69 87.1,57.6 87.1,61.7 J9.3
  Top 0.305: B1.28 69.24,92.66 69.24,88.08 69.27,88.06 69.27,62.2
LED4
  Top 0.254: 69.72,62.39 69.72,60.18 72.6,57.3 78.8,57.3 79.8,58.3 J9.4
  Top 0.305: B1.29 70.67,95.85 71.92,94.61 71.92,93.57 71.19,92.84 70.15,92.84 69.7,92.4 69.7,88.27 69.72,88.25 69.72,62.39
LED5
  Top 0.254: J10.1 79.2,76.2 80.6,77.6 90.2,77.6 91.5,76.3 91.5,68.16 91.1,67.76 71,67.76 70.16,68.6 70.18,68.6 | 70.17,91.6 70.96,92.39 71.3,92.39
  Top 0.305: B1.30 71.51,92.39 71.3,92.39 | 70.17,91.6 70.17,88.45 70.18,88.44 70.18,68.6
LED6
  Top 0.254: J10.2 82.2,75.9 83.4,77.1 89.99,77.1 91.09,76 91.09,68.69 90.7,68.3 71.44,68.3 70.64,69.1 | 70.64,91.2 71.37,91.93 71.7,91.93
  Top 0.305: B1.31 73.21,95.85 74.45,94.61 74.45,93.57 72.81,91.93 71.7,91.93 | 70.64,69.1 70.64,91.2
LED7
  Top 0.254: J10.3 89.89,74.5 90.69,73.7 90.69,69.19 90.3,68.81 71.9,68.81 71.09,69.61 | 71.09,90.7 71.87,91.47 71.9,91.47
  Top 0.305: B1.32 73.13,91.47 71.9,91.47 | 71.09,69.61 71.09,90.7
LED8
  Top 0.254: J10.4 79.2,71.6 78.58,72.21 72.84,72.21 71.55,73.5
  Top 0.305: B1.33 75.75,95.85 77,94.61 77,93.57 74.44,91.02 72.27,91.02 71.55,90.29 71.55,73.5
N$1
  Top 1.27: B1.VIN 111.37,45.83 J13.1
N$3
  Top 0.254: Q4.3 18.37,80.83 D4.C 21.17,81.57 22.63,83.03 PS6.1 PS2.1
N$5
  Top 0.254: R6.1 16.8,81.75 D4.A
N$6
  Top 0.254: Q4.1 R5.2
N$7
  Top 0.254: D3.A 50.12,86.23 R7.2
N$8
  Top 0.254: R7.1 52.96,87.11 52.96,91.5 51.8,92.66 48.92,92.66
  Top 2.54: X14.1 48.92,92.66 X16.1 | X15.1 42.97,90.62 D22.3
  pour Top (isolate 0.1, rank 2, no thermals): 50.4,94.1 50.3,94.2 30.3,94.2 29.5,93.4 29.5,85.3 29.7,85.1 48.9,85.1 49.4,85.6 49.4,90.3 50.8,91.7 50.8,93.5
N$9  (1 unrouted)
  Top 0.254: J1.5 40.8,48.9 J1.1 43.53,48.9
  Top 1.27: X10.1 43.53,48.9 40.8,48.9 | J1.1 J1.5
N$10  (1 unrouted)
  Top 0.254: 22.1,49 J3.1
  Top 1.27: X4.1 25,49 22.1,49 | J3.1 J3.5
N$11
  Top 0.254: X12.3 46.34,37.7 K8.5
N$12  (1 unrouted)
  Top 0.254: 25.06,5.9 J4.1 21.3,5.9 J4.5
  Top 1.27: X18.1 25.06,5.9 21.3,5.9 | J4.1 J4.5
N$13  (1 unrouted)
  Top 0.254: 40.4,5.7 J5.1
  Top 1.27: X19.1 44.66,5.7 40.4,5.7 | J5.1 J5.5
N$14
  Top 0.254: 22.18,55.02 D10.A 21.15,51.97 D11.C | 22.18,55.02 22.25,55.1 Q7.3 | K5.13 19.46,57.74 22.18,55.02
N$15
  Top 0.254: D11.A 17.25,51.5 R12.1
N$16
  Top 0.254: Q7.1 R11.2
N$17
  Top 0.254: D13.C 39.58,53.13 D12.A 41.55,55.1 | 41.55,55.1 Q8.3 | K6.13 38.26,58.39 41.55,55.1
N$18
  Top 0.254: R16.1 37.57,51.65 D13.A
N$19
  Top 0.254: Q8.1 41.75,51.6 R15.2
N$20
  Top 0.254: D15.C 20.78,34.83 D14.A 22.35,36.4 Q9.3 19.26,40.94 K7.13
N$21
  Top 0.254: R20.1 18.57,33.05 D15.A
N$22
  Top 0.254: Q9.1 22.95,34.2 R19.2
N$23
  Top 0.254: K8.13 38.46,40.64 Q10.3 41.55,36.2 D16.A 39.98,34.63 D17.C
N$24
  Top 0.254: R22.1 37.87,32.95 D17.A
N$25
  Top 0.254: Q10.1 42.05,34 R21.2
N$26
  Top 0.254: X11.3 26.94,37.7 K7.5
N$28  (1 unrouted)
  Top 0.254: 21.6,30.1 J7.1
  Top 1.016: 21.6,30.1 21.9,30.1
  Top 1.27: J7.5 21.6,30.1 | J7.1 21.9,30.1 24.46,30.1 X11.1
N$29
  Top 0.254: R13.1 D7.A
N$30
  Top 0.254: X4.3 27.18,56.5 K5.5
N$31
  Top 0.254: K6.5 50.91,51.47 X10.3
N$34
  Top 0.152: D22.1 D22.2 49.37,89.12 C2.1
  Top 0.254: D22.1 48.03,86.21 PS6.11 | PS6.11 PS6.9 | PS6.11 PS2.11 PS2.9
  pour Top (isolate 0.1, no thermals): 50.9,90.7 50.8,90.6 46,90.6 45.9,90.5 45.9,85.9 45.7,85.7 42.1,85.7 42.1,71.2 42.2,71.1 49.3,71.1 49.5,71.3 49.5,88.5 49.9,88.9 51.1,88.9 51.1,90.3
N$38  (1 unrouted)
  Top 0.254: X12.1 43.86,30.1 40.9,30.1 J8.1 J8.5
  Top 2.54: J8.5 40.9,30.1 | J8.1 44.9,30.1 46.36,31.56 X12.1
N$42
  Top 0.254: K9.13 18.76,16.24 Q11.3 21.25,11.9 D18.A 19.68,10.33 D19.C
N$43
  Top 0.254: R23.1 17.05,8.4 D19.A
N$44
  Top 0.254: R14.2 22.25,9.7 Q11.1
N$45
  Top 0.254: Q12.3 43.1,11.8 | 43.1,11.8 38.66,16.24 K10.13 | D21.C 39.78,10.53 D20.A 41.05,11.8 43.1,11.8
N$46
  Top 0.254: R25.1 37.07,9.35 D21.A
N$47
  Top 0.254: R24.2 Q12.1
N$48
  Top 0.254: X19.3 51.64,8.14 K10.5
N$49
  Top 0.254: X18.3 31.64,8.34 K9.5
SCL-5V
  Bottom 0.305: B1.21 60.51,87.57 61.34,88.4 78.3,88.4 J11.2
SDA-5V
  Bottom 0.305: B1.20 71.63,83.93 74.9,87.2 J11.1
SERVO-D1
  Top 0.254: X14.3 38.72,97.74 40.11,96.34 52.2,96.34 | 52.2,96.34 52.36,96.34 | 52.2,96.34 59.93,88.61 65.67,88.61 67.11,87.17 67.11,34.23 63.52,30.64 60.01,30.64 59.29,31.36 59.29,32.37 60.51,33.58 B1.11
SERVO-D2
  Top 0.254: X15.3 46.72,97.81 47.78,96.75 53.45,96.75 61.19,89.01 65.84,89.01 67.51,87.34 67.51,33.4 62.22,28.1 60.01,28.1 58.88,29.22 58.88,34.5 60.51,36.12 B1.10
SERVO-H1
  Top 0.254: X16.3 54.22,97.78 62.58,89.42 66,89.42 67.92,87.5 67.92,32.47 61.02,25.56 60.01,25.56 58.48,27.09 58.48,36.63 60.51,38.66 B1.9
SERVOPWR
  Top 0.254: B1.12 63.46,31.86 66.7,35.1 66.7,87 65.5,88.2 60.4,88.2 60.4,88.08 56.19,83.87 56.19,66.54 54.95,65.3 21.8,65.3 20.3,66.8 20.3,74.2 R5.1
SS1-RX
  Top 0.254: B1.42 94.35,88.19 94.35,51.06 95.8,49.61 124.58,49.61 126.25,47.94 X8.4
SS1-TX
  Top 0.254: B1.40 93.91,86.09 93.91,50.7 95.41,49.2 124.42,49.2 X8.3
SS2-RX
  Top 0.254: B1.38 93.37,84.09 93.37,50.6 96.18,47.79 X9.4
SS2-TX
  Top 0.254: B1.36 92.83,82.09 92.83,50.4 95.93,47.3 116.21,47.3 X9.3
TEMP-C1
  Top 0.254: B1.A15 111.25,91.55 114.01,94.31 X5.3
TEMP-HC1
  Top 0.254: X6.3 126.36,93.2 113.7,93.2 109.51,89.01 B1.A14
TEMP-HC2
  Top 0.254: B1.A13 114.67,86.47 X7.3
VCC  (via drill 0.35)  (1 unrouted)
  Top 0.254: D12.C 36.05,53.6 R16.2 35.8,56.42 K6.1 | K5.1 16.92,53.53 R12.2 18.3,53.45 D10.C | K7.1 16.72,34.93 R20.2 18.4,34.75 D14.C | D16.C 36.35,35 R22.2 36,37.62 K8.1 | D20.C 37.7,11.05 R25.2 36.12,11.17 K10.1 | K9.1 16.22,11.17 R23.2 17.6,11.05 D18.C
  Top 0.305: B1.AREF 70.15,14.6 101.7,14.6 115.5,28.4 115.5,37.41 X9.1
  Top 1.27: X5.1 124.63,89.23 | X6.1 127.47,89.23 124.63,89.23 | 124.63,89.23 122.6,87.2 122.6,80.2 120.76,78.36 X7.1 123.26,72.8 129.3,72.8 131,71.1 131,63.6 | X3.1 X2.1 129.63,54.06 131,52.7 | X1.1 127.84,65.25 X17.1 129.23,65.37 131,63.6 | 128.06,40.17 X9.1 114.49,40.17 J13.2 | 128.06,40.17 X8.1 128.22,34.33 PS3.3 | 131,52.7 131,41.9 129.27,40.17 128.06,40.17 | 131,63.6 131,52.7 | PS3.3 PS4.3 123.54,18.65 PS1.3 | R13.2 123.64,29.51 PS3.3
  Bottom 1.016: X5.1 115.97,89.23 111.5,93.7 107.3,93.7 99.33,85.72 80.53,85.72 79.5,84.7 J11.5
  other vias: 27.1,66.9 28.2,66.9 29.2,66.9 30.2,66.9 31.1,66.9 32.2,66.9 33.1,67 30.6,62.4 31.6,62.4 32.6,62.4 33.6,62.4 34.5,62.4
  pour Top (isolate 0.1, rank 5, no thermals): 18.1,86.3 15.1,86.3 14.8,86 14.8,2.7 16.6,0.9 52.3,0.9 55.1,3.7 55.1,90.2 53.5,91.8 19.5,91.8 18.4,90.7
  pour Top (isolate 0.1, rank 6, no thermals): 4.1,101.8 -0.5,101.8 -1.1,101.2 -1.1,0.7 1.7,-2.1 132.8,-2.1 135.4,0.5 135.4,99.3 132.9,101.8 91.9,101.8 91.3,101.2
VCC_1  (via drill 0.35)  (5 unrouted)
  Top 0.254: PS2.2 30.2,72.75 | 30.2,72.75 PS2.4 | PS6.2 PS6.4 30.25,72.8 30.2,72.75
  Top 1.016: J4.6 18.16,1.52 33.4,1.52 35.02,3.14 J5.6
  Top 1.27: J8.6 35.52,24.18 38.14,21.56 | 38.14,21.56 X21.1 | 38.14,21.56 19.14,21.56 16.72,23.98 J7.6 13.4,24.24 | J4.6 14.54,3.36 13.4,4.5 13.4,24.24 | 13.4,24.24 13.4,43.24 J3.6 16.71,46.46 18.67,44.5 22.8,44.5 24.7,46.4 26,46.4 26.04,46.36 J1.6 | PS1.1 118.56,7.65 PS3.1 PS4.1 | J6.1B 14.89,90.39 12.5,88 J6.1A
  Bottom 0.152: 58,15.8 58,16.5 | 82.2,58.8 82.8,59.4 J9.5
  Bottom 1.27: X21.1 52.94,21.56 58,16.5 65.4,9.1 | PS4.1 101.91,2.1 71.7,2.1 65.4,8.4 65.4,9.1 | v30.4,46.4 26.3,46.4 24,48.7 24,69.04 PS2.3 | 82.2,58.8 65.4,42 65.4,9.1
  other vias: 27.3,46.4 26.1,46.4 28.4,46.4 29.4,46.4
  pour Top (isolate 0.1, no thermals): 24,84.7 24,71 24.2,70.8 31.5,70.8 31.5,84.7
  pour Top (isolate 0.1, no thermals): 18.3,94.8 12.6,94.8 12.6,90.8 10.3,88.5 10.3,85.7 11.2,84.8 23.9,84.8 24,84.7 24,82.4 31.4,82.4 31.5,82.5 31.5,84.5 31.4,84.6 31.2,84.8 28.6,84.8 28.4,84.8 18.7,94.5
  pour Bottom (no thermals): 84.2,72.9 84.1,73 81,73 80.6,72.6 80.6,70.2 79.1,68.7 76.5,68.7 74.4,66.6 74.4,55.6 77.7,52.3 79.4,52.3 82.4,52.3 84.7,54.6 84.7,57.2 84.1,57.8 84.1,71.4
WL-C1
  Top 0.254: X2.3 126.95,59.15 125.8,60.3 115.62,60.3 B1.A1
WL-H1
  Top 0.254: X1.3 114.9,67.07 114.9,61.7 109.19,55.99 B1.A2
WL-R1
  Top 0.254: X3.3 109.91,50.91 B1.A0
WP1
  Top 0.254: X17.3 126.81,71.6 116.5,71.6 114,69.1 114,61.6 110.93,58.53 B1.A3
WPUMP-C1
  Top 0.254: R15.1 44.5,52.45 44.5,61.1 46.59,63.19 52.5,63.19 53.8,61.89 53.8,49.6 55.03,48.37 B1.6
WPUMP-T1
  Top 0.254: R11.1 25.9,52.85 25.9,60.4 29.1,63.6 52.67,63.6 | 52.67,63.6 52.7,63.6 | 52.67,63.6 54.21,62.06 54.21,50.9 55.51,49.6 61.8,49.6 62.4,49 62.4,46.62 61.61,45.83 B1.7